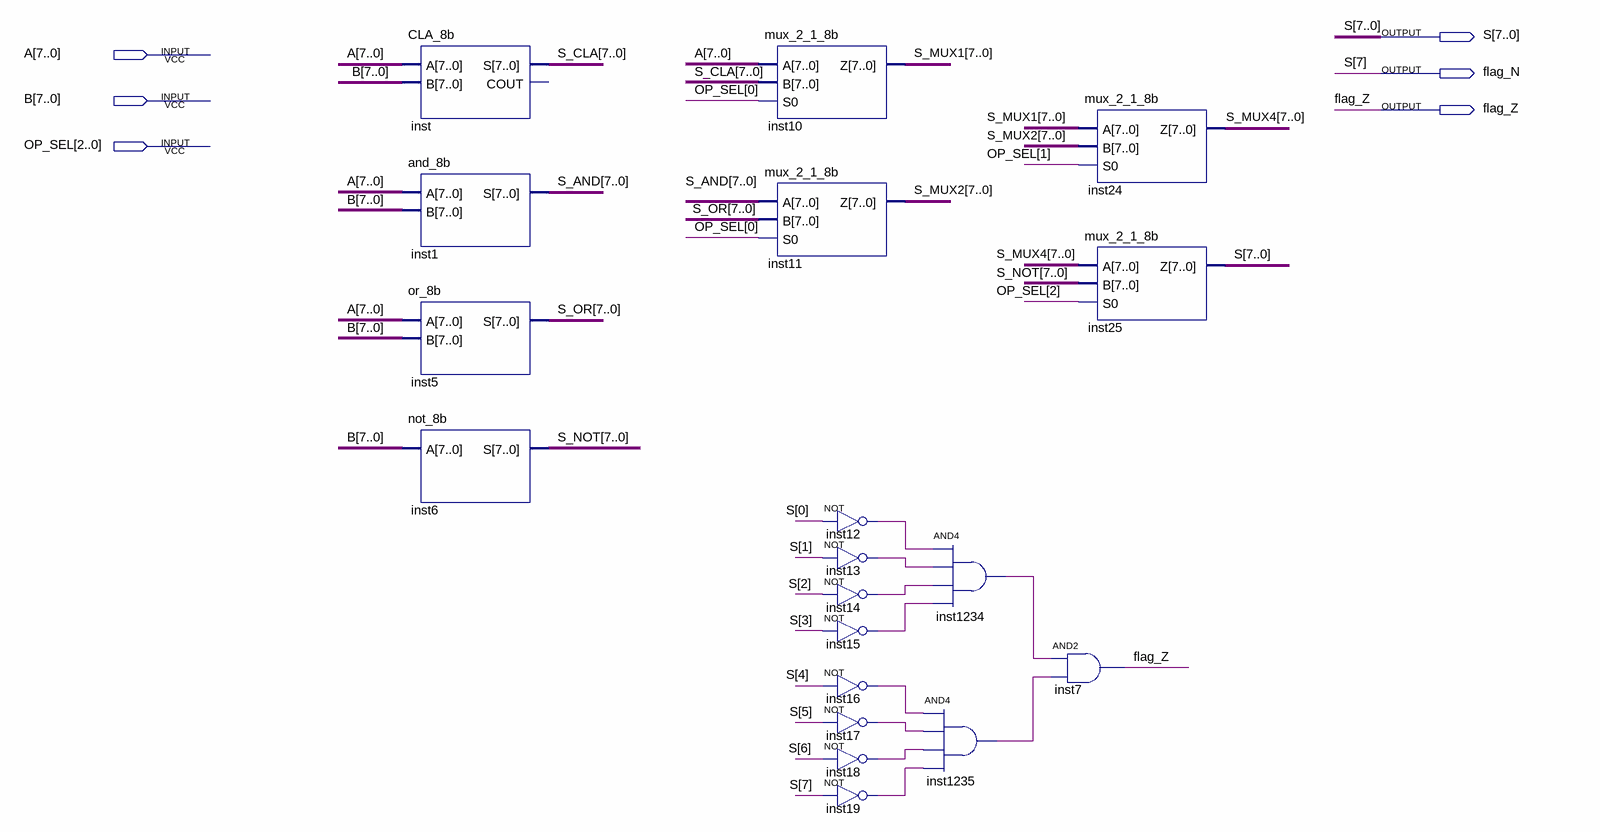
[diagram p0: schematic sheet]
// Quartus schematic ULA.bdf as structural Verilog: 19 symbols, 6 pins
module ULA (
  input  [7:0] A,
  input  [7:0] B,
  input  [2:0] OP_SEL,
  output [7:0] S,
  output flag_N,
  output flag_Z
);

  wire inst12_out, inst13_out, inst14_out, inst15_out, inst16_out, inst17_out, inst18_out, inst19_out,
       inst1234_out, inst1235_out;
  wire [7:0] S_AND, S_CLA, S_MUX1, S_MUX2, S_MUX4, S_NOT, S_OR;

  CLA_8b inst (.A(A), .B(B), .S(S_CLA));  // open: COUT
  and_8b inst1 (.A(A), .B(B), .S(S_AND));
  or_8b inst5 (.A(A), .B(B), .S(S_OR));
  not_8b inst6 (.A(B), .S(S_NOT));
  mux_2_1_8b inst10 (.A(A), .B(S_CLA), .S0(OP_SEL[0]), .Z(S_MUX1));
  mux_2_1_8b inst11 (.A(S_AND), .B(S_OR), .S0(OP_SEL[0]), .Z(S_MUX2));
  not inst12 (inst12_out, S[0]);
  not inst13 (inst13_out, S[1]);
  not inst14 (inst14_out, S[2]);
  not inst15 (inst15_out, S[3]);
  not inst16 (inst16_out, S[4]);
  not inst17 (inst17_out, S[5]);
  not inst18 (inst18_out, S[6]);
  not inst19 (inst19_out, flag_N);
  and inst1234 (inst1234_out, inst12_out, inst13_out, inst14_out, inst15_out);
  and inst1235 (inst1235_out, inst16_out, inst17_out, inst18_out, inst19_out);
  mux_2_1_8b inst24 (.A(S_MUX1), .B(S_MUX2), .S0(OP_SEL[1]), .Z(S_MUX4));
  mux_2_1_8b inst25 (.A(S_MUX4), .B(S_NOT), .S0(OP_SEL[2]), .Z({flag_N, S[6:0]}));
  and inst7 (flag_Z, inst1234_out, inst1235_out);

  assign S[7] = flag_N;
endmodule
